# EasyEDA schematic SCH.json
TITLE: Navirover; REV: 1.0; Date: 2024-05-15; Sheet: 1/1; Drawn By: nimit.vijayvargee
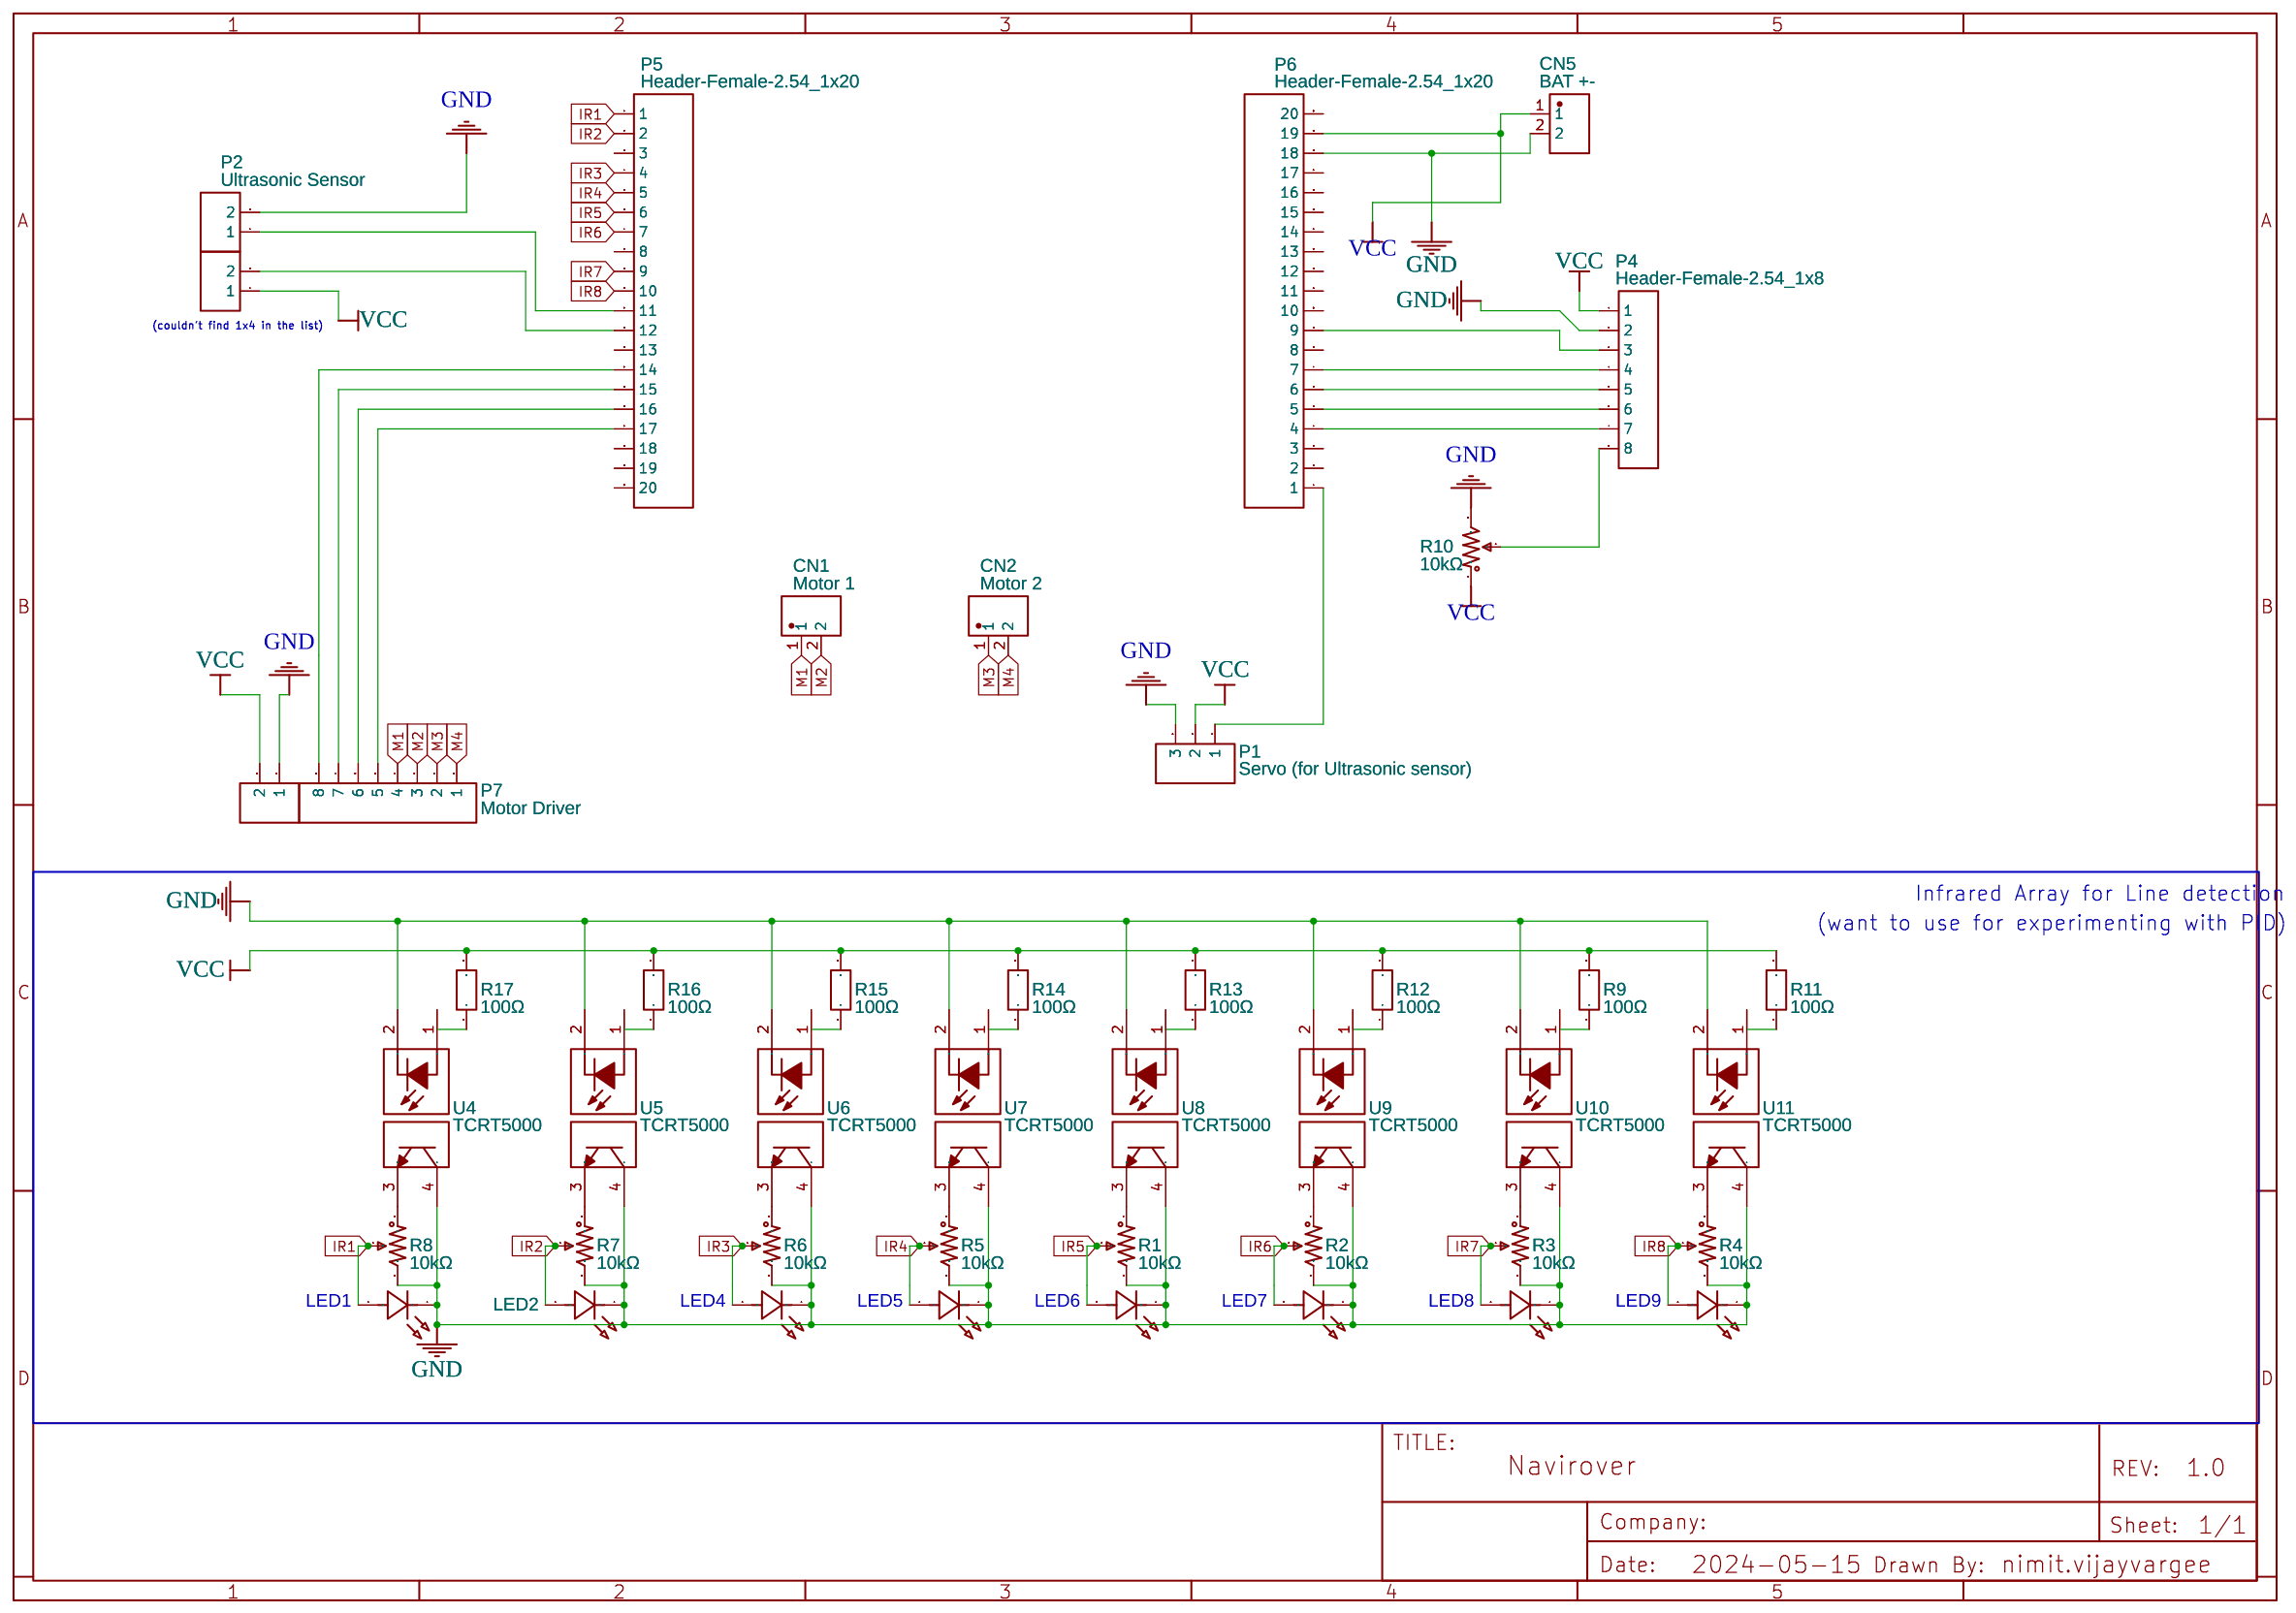
[diagram p0: schematic sheet]

## Parts
CN1  Motor 1  [CONN-TH_2P-P5.0-MX301-5.0-02P-BU01-CU-Y-A]
CN2  Motor 2  [CONN-TH_2P-P5.0-MX301-5.0-02P-BU01-CU-Y-A]
CN5  BAT +-  [CONN-TH_2P-P5.0-MX301-5.0-02P-BU01-CU-Y-A]
LED1  TJ-S1005CL4T5ALC3DW-A5  [LED0402-RD]
LED2  TJ-S1005CL4T5ALC3DW-A5  [LED0402-RD]
LED3  TJ-S1005CL4T5ALC3DW-A5  [LED0402-RD]
LED4  TJ-S1005CL4T5ALC3DW-A5  [LED0402-RD]
LED5  TJ-S1005CL4T5ALC3DW-A5  [LED0402-RD]
LED6  TJ-S1005CL4T5ALC3DW-A5  [LED0402-RD]
LED7  TJ-S1005CL4T5ALC3DW-A5  [LED0402-RD]
LED8  TJ-S1005CL4T5ALC3DW-A5  [LED0402-RD]
P1  Servo (for Ultrasonic sensor)  [HDR-TH_3P-P2.54-V-F]
P2  Ultrasonic Sensor  [HDR-TH_2P-P2.54-V-F]
P3  Header-Female-2.54_1x2  [HDR-TH_2P-P2.54-V-F]
P4  Header-Female-2.54_1x8  [HDR-TH_8P-P2.54-V-F-1]
P5  Header-Female-2.54_1x20  [HDR-TH_20P-P2.54-V-F]
P6  Header-Female-2.54_1x20  [HDR-TH_20P-P2.54-V-F]
P7  Motor Driver  [HDR-TH_8P-P2.54-V-F-1]
P8  Header-Female-2.54_1x2  [HDR-TH_2P-P2.54-V-F]
R1  10kΩ  [RES-ADJ-TH_3P-L10.0-W10.0-P2.50-L]
R2  10kΩ  [RES-ADJ-TH_3P-L10.0-W10.0-P2.50-L]
R3  10kΩ  [RES-ADJ-TH_3P-L10.0-W10.0-P2.50-L]
R4  10kΩ  [RES-ADJ-TH_3P-L10.0-W10.0-P2.50-L]
R5  10kΩ  [RES-ADJ-TH_3P-L10.0-W10.0-P2.50-L]
R6  10kΩ  [RES-ADJ-TH_3P-L10.0-W10.0-P2.50-L]
R7  10kΩ  [RES-ADJ-TH_3P-L10.0-W10.0-P2.50-L]
R8  10kΩ  [RES-ADJ-TH_3P-L10.0-W10.0-P2.50-L]
R9  100Ω  [R0805]
R10  10kΩ  [RES-ADJ-TH_3P-L10.0-W10.0-P2.50-L]
R11  100Ω  [R0805]
R12  100Ω  [R0805]
R13  100Ω  [R0805]
R14  100Ω  [R0805]
R15  100Ω  [R0805]
R16  100Ω  [R0805]
R17  100Ω  [R0805]
U4  TCRT5000  [OPTO-TH_TCRT5000]
U5  TCRT5000  [OPTO-TH_TCRT5000]
U6  TCRT5000  [OPTO-TH_TCRT5000]
U7  TCRT5000  [OPTO-TH_TCRT5000]
U8  TCRT5000  [OPTO-TH_TCRT5000]
U9  TCRT5000  [OPTO-TH_TCRT5000]
U10  TCRT5000  [OPTO-TH_TCRT5000]
U11  TCRT5000  [OPTO-TH_TCRT5000]

## Library data of the parts
CN1 CN2 CN5 = MX301-5.0-02P-BU01-CU-Y-A: Supplier: LCSC; Supplier Part: C5188422; Manufacturer: MAX(迈旭); Manufacturer Part: MX301-5.0-02P-BU01-Cu-Y-A; Contributor: lcsc; JLCPCB Part Class: Extended Part
LED1-LED8 = TJ-S1005CL4T5ALC3DW-A5: Contributor: LCSC; Supplier: LCSC; Supplier Part: C917191; Manufacturer: TOGIALED(统佳); JLCPCB Part Class: Extended Part
P1 = Header-Female-2.54_1x3: Supplier Part: C146243; Supplier: LCSC; Manufacturer: BOOMELE(博穆精密); Manufacturer Part: 2.54-1*3P母; JLCPCB Part Class: Extended Part
P2 P3 P8 = Header-Female-2.54_1x2: Supplier: LCSC; Manufacturer: BOOMELE(博穆精密); Manufacturer Part: 2.54-1*2P母; Supplier Part: C49661; JLCPCB Part Class: Extended Part
P4 P7 = Header-Female-2.54_1x8: Supplier: LCSC; Manufacturer: BOOMELE(博穆精密); Manufacturer Part: 2.54-1*8P母环保; Supplier Part: C27438; JLCPCB Part Class: Extended Part
P5 P6 = Header-Female-2.54_1x20: Supplier: LCSC; Manufacturer: BOOMELE(博穆精密); Manufacturer Part: 2.54-1*20P母; Supplier Part: C50984; JLCPCB Part Class: Extended Part
R1-R8 R10 = 3296W-1-103: Resistance(Ohms): 10K; Contributor: LCSC; Supplier: LCSC; Supplier Part: C118954; Manufacturer: BOCHEN(博晨); JLCPCB Part Class: Extended Part
R9 R11-R17 = CQ05W8J0101T5E: Contributor: LCSC; Supplier: LCSC; Supplier Part: C966526; Manufacturer: UNI-ROYAL(厚声); JLCPCB Part Class: Extended Part
U4-U11 = TCRT5000: Contributor: lcsc; Supplier: LCSC; Supplier Part: C2984661; Manufacturer: VISHAY(威世); JLCPCB Part Class: Extended Part

## Nets
GND: CN5.2 LED1.1(K) LED2.1(K) LED3.1(K) LED4.1(K) LED5.1(K) LED6.1(K) LED7.1(K) LED8.1(K) P1.3 P2.2 P4.2 P6.18 P8.1 R1.3 R2.3 R3.3 R4.3 R5.3 R6.3 R7.3 R8.3 R10.3 U4.2 U4.4 U5.2 U5.4 U6.2 U6.4 U7.2 U7.4 U8.2 U8.4 U9.2 U9.4 U10.2 U10.4 U11.2 U11.4
VCC: CN5.1 P1.2 P3.1 P4.1 P6.19 P8.2 R9.2 R10.1 R11.2 R12.2 R13.2 R14.2 R15.2 R16.2 R17.2
IR1: LED3.2(A) P5.1 R8.2
IR2: LED2.2(A) P5.2 R7.2
IR3: LED1.2(A) P5.4 R6.2
IR4: LED4.2(A) P5.5 R5.2
IR5: LED5.2(A) P5.6 R1.2
IR6: LED6.2(A) P5.7 R2.2
IR7: LED7.2(A) P5.9 R3.2
IR8: LED8.2(A) P5.10 R4.2
M1: CN1.1 P7.4
M2: CN1.2 P7.3
M3: CN2.1 P7.2
M4: CN2.2 P7.1
Net-(P1-1): P1.1 P6.1
Net-(P2-1): P2.1 P5.11
Net-(P3-2): P3.2 P5.12
Net-(P4-3): P4.3 P6.9
Net-(P4-4): P4.4 P6.7
Net-(P4-5): P4.5 P6.6
Net-(P4-6): P4.6 P6.5
Net-(P4-7): P4.7 P6.4
Net-(P4-8): P4.8 R10.2
Net-(P5-14): P5.14 P7.8
Net-(P5-15): P5.15 P7.7
Net-(P5-16): P5.16 P7.6
Net-(P5-17): P5.17 P7.5
Net-(R1-1): R1.1 U8.3
Net-(R2-1): R2.1 U9.3
Net-(R3-1): R3.1 U10.3
Net-(R4-1): R4.1 U11.3
Net-(R5-1): R5.1 U7.3
Net-(R6-1): R6.1 U6.3
Net-(R7-1): R7.1 U5.3
Net-(R8-1): R8.1 U4.3
Net-(R9-1): R9.1 U10.1
Net-(R11-1): R11.1 U11.1
Net-(R12-1): R12.1 U9.1
Net-(R13-1): R13.1 U8.1
Net-(R14-1): R14.1 U7.1
Net-(R15-1): R15.1 U6.1
Net-(R16-1): R16.1 U5.1
Net-(R17-1): R17.1 U4.1

Not connected (* = marked no-connect by the designer): P5 3 8 13 18 19 20; P6 2 3 8 10 11 12 13 14 15 16 17 20

## Notes on the sheet
- (couldn't find 1x4 in the list)
- Infrared Array for Line detection
- (want to use for experimenting with PID)
- LED1
- LED4
- LED5
- LED6
- LED7
- LED8
- LED9
